# Altium project CourseWork_Boyko.PrjPcb
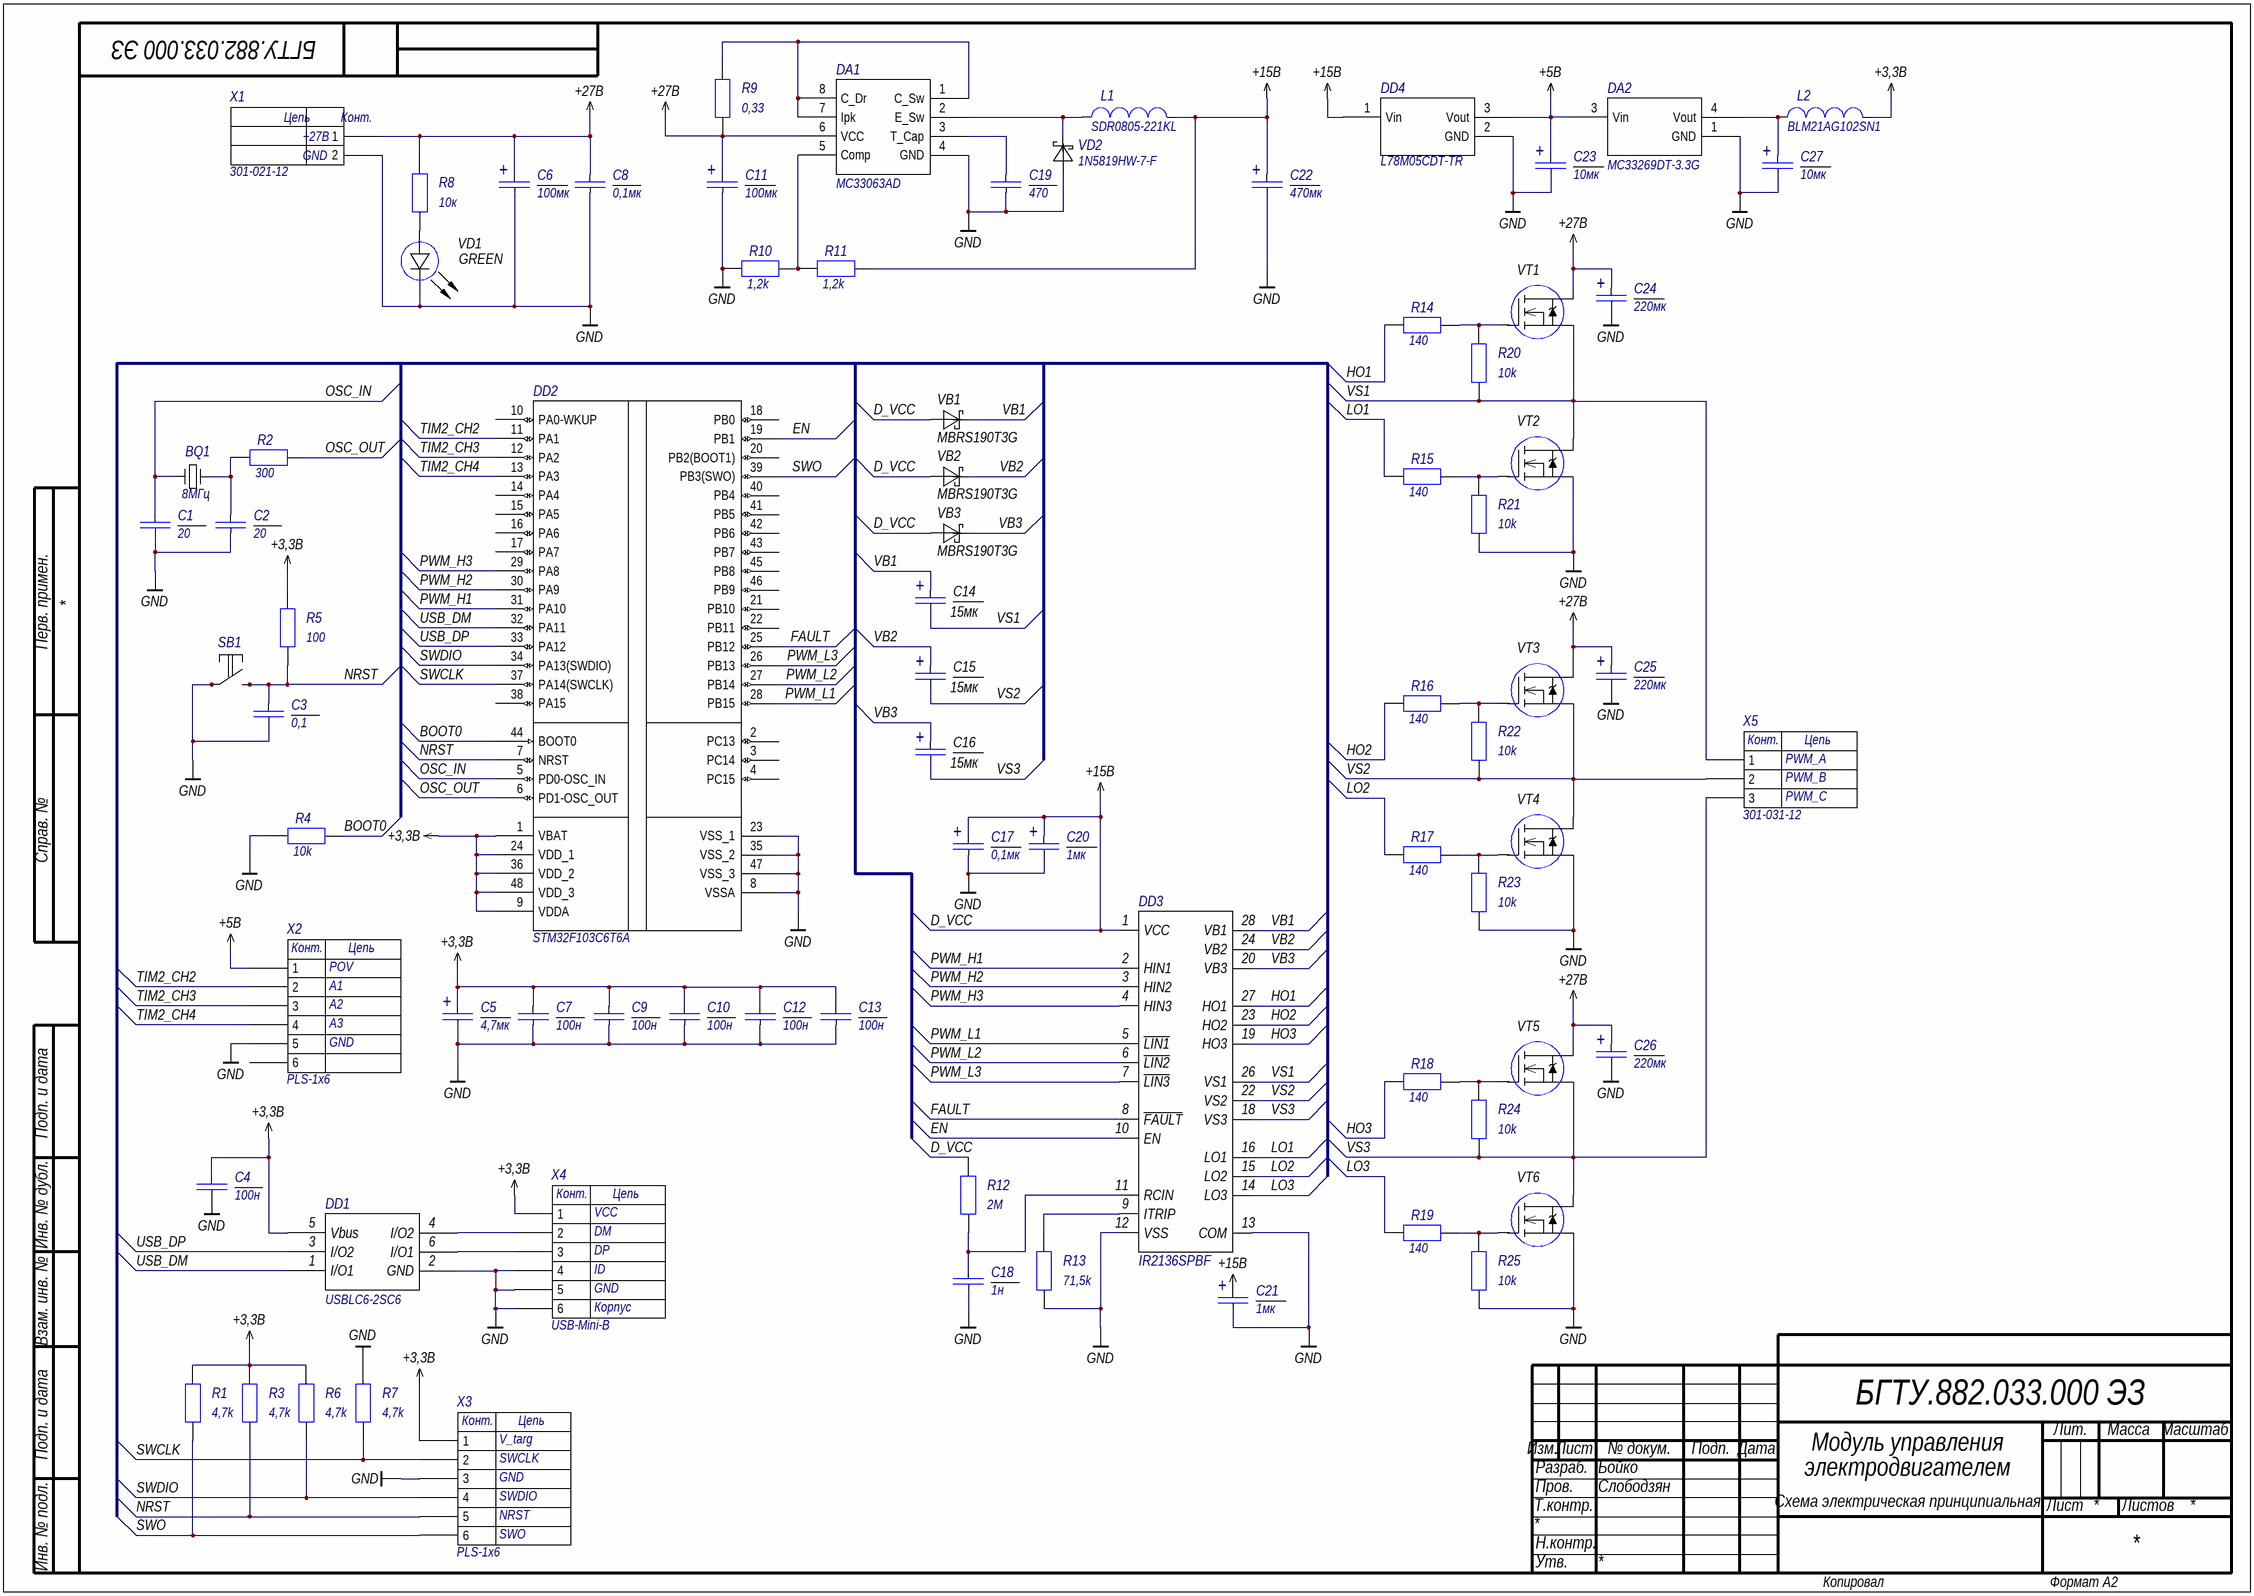
[diagram p0: EngineControlCircuitSCH_Boyko.SchDoc]
Обозначение_PCB: БГТУ.882.033.000; п_Пров_Р: Слободзян Н.С.; п_Разраб_Р: Бойко А.Ю.
1 sheet, 78 parts. Net scope: global (net labels, ports and power ports of the same name join across sheets).
Board files: EngineControl.PcbDoc, EngineControlPCBRC1.PcbDoc

## Sheet EngineControlCircuitSCH_Boyko.SchDoc
size 594 x 420 mm; CheckedBy: Слободзян; DrawnBy: Бойко; DocumentNumber: БГТУ.882.033.000 ЭЗ; Title1str: Модуль управления; Title2str: электродвигателем; DocumentType2str: Cхема электрическая принципиальная

### Parts
BQ1  8МГц  [OSC: 3225]
C1  20  [CAPC1608X90N]
C2  20  [CAPC1608X90N]
C3  0,1  [CAPC1005X55N]
C4  100н  [CAPC1005X55N]
C5  4,7мк  [CAP: TANTAL-B]
C6  100мк  [CAP: D6.3C2.5H11]
C7  100н  [CAPC1005X55N]
C8  0,1мк  [CAPC2012X135N]
C9  100н  [CAPC1005X55N]
C10  100н  [CAPC1005X55N]
C11  100мк  [CAP: SMD D6.3A6.6H7.7]
C12  100н  [CAPC1005X55N]
C13  100н  [CAPC1005X55N]
C14  15мк  [CAPMP7343X310N]
C15  15мк  [CAPMP7343X310N]
C16  15мк  [CAPMP7343X310N]
C17  0,1мк  [CAPMP3216X180N]
C18  1н  [CAPC2012X135N]
C19  470  [CAPC1005X55N]
C20  1мк  [CAPMP3216X180N]
C21  1мк  [CAP: D5C2H11]
C22  470мк  [CAP_ELEC_SIZE_G]
C23  10мк  [CAP: D5C2H11]
C24  220мк  [WCAP-ATUL 8x11.5x3.5x0.5]
C25  220мк  [WCAP-ATUL 8x11.5x3.5x0.5]
C26  220мк  [WCAP-ATUL 8x11.5x3.5x0.5]
C27  10мк  [CAP: D5C2H11]
DA1  MC33063AD  [8-SOIC-PAD]
DA2  MC33269DT-3.3G  [369A-13]
DD1  USBLC6-2SC6  [SOT23-6]
DD2  STM32F103C6T6A  [LQFP-48_N]
DD3  IR2136SPBF  [SOIC127PX1032X265-28N]
DD4  L78M05CDT-TR  [369A-13]
L1  SDR0805-221KL  [IND: SDR0805]
L2  BLM21AG102SN1  [IND: 0805]
R1  4,7k  [RES0805]
R2  300  [RES0402]
R3  4,7k  [RES0805]
R4  10k  [RES0805]
R5  100  [RES0805]
R6  4,7k  [RES0805]
R7  4,7k  [RES0805]
R8  10к  [RES0805]
R9  0,33  [RES1206]
R10  1,2k  [RES0805]
R11  1,2k  [RES0805]
R12  2M  [RES0402]
R13  71,5k  [RES0805]
R14  140  [RES0805]
R15  140  [RES0805]
R16  140  [RES0805]
R17  140  [RES0805]
R18  140  [RES0805]
R19  140  [RES0805]
R20  10k  [RES0805]
R21  10k  [RES0805]
R22  10k  [RES0805]
R23  10k  [RES0805]
R24  10k  [RES0805]
R25  10k  [RES0805]
SB1  SWT-34  [SWT-34]  (value not drawn)
VB1  MBRS190T3G  [DIODE: SMB]
VB2  MBRS190T3G  [DIODE: SMB]
VB3  MBRS190T3G  [DIODE: SMB]
VD1  Color: GREEN  [LED: 0805G]
VD2  1N5819HW-7-F  [DO-214AA]
VT1  IRFZ14PBF  [TO220]  (value not drawn)
VT2  IRFZ14PBF  [TO220]  (value not drawn)
VT3  IRFZ14PBF  [TO220]  (value not drawn)
VT4  IRFZ14PBF  [TO220]  (value not drawn)
VT5  IRFZ14PBF  [TO220]  (value not drawn)
VT6  IRFZ14PBF  [TO220]  (value not drawn)
X1  301-021-12  [301-021-12_3D]
X2  PLS-1x6  [CON: PLS-6]
X3  PLS-1x6  [CON: PLS-6]
X4  USB-Mini-B  [USB-MINI]
X5  301-031-12  [301-031-12_3D]

### Nets
+3,3B: C4.1 C5.1 C7.1 C9.1 C10.1 C12.1 C13.1 DD1.5(Vbus) DD2.1(VBAT) DD2.9(VDDA) DD2.24(VDD_1) DD2.36(VDD_2) DD2.48(VDD_3) L2.2 R1.1 R3.1 R5.1 R6.1 X3.1 X4.1
+5B: C23.1 DA2.3(Vin) DD4.3(Vout) X2.1
+27B: C6.1 C8.1 C11.1 C24.1 C25.1 C26.1 DA1.6(VCC) R8.1 R9.2 VT1.3 VT3.3 VT5.3 X1.1
D_VCC: C17.1 C20.1 C21.1 C22.1 DD3.1(VCC) DD4.1(Vin) L1.2 R11.2 R12.1 VB1.1 VB2.1 VB3.1  [also labelled +15B]
GND: C1.2 C2.2 C3.2 C4.2 C5.2 C6.2 C7.2 C8.2 C9.2 C10.2 C11.2 C12.2 C13.2 C17.2 C18.2 C19.2 C20.2 C21.2 C22.2 C23.2 C24.2 C25.2 C26.2 C27.2 DA1.4(GND) DA2.1(GND) DD1.2(GND) DD2.8(VSSA) DD2.23(VSS_1) DD2.35(VSS_2) DD2.47(VSS_3) DD3.12(VSS) DD3.13(COM) DD4.2(GND) R4.1 R7.1 R10.1 R13.2 R21.2 R23.2 R25.2 SB1.1 SB1.2 VD1.2(C) VD2.1 VT2.2 VT4.2 VT6.2 X1.2 X2.5 X3.3 X4.4 X4.5 X4.6
BOOT0: DD2.44(BOOT0) R4.2
EN: DD2.19(PB1) DD3.10(EN)
FAULT: DD2.25(PB12) DD3.8(~{FAULT})
HO1: DD3.27(HO1) R14.1
HO2: DD3.23(HO2) R16.1
HO3: DD3.19(HO3) R18.1
LO1: DD3.16(LO1) R15.1
LO2: DD3.15(LO2) R17.1
LO3: DD3.14(LO3) R19.1
NRST: C3.1 DD2.7(NRST) R3.2 R5.2 SB1.3 SB1.4 X3.5
OSC_IN: BQ1.1(OSC1) C1.1 DD2.5(PD0-OSC_IN)
OSC_OUT: DD2.6(PD1-OSC_OUT) R2.2
PWM_H1: DD2.31(PA10) DD3.2(HIN1)
PWM_H2: DD2.30(PA9) DD3.3(HIN2)
PWM_H3: DD2.29(PA8) DD3.4(HIN3)
PWM_L1: DD2.28(PB15) DD3.5(~{LIN1})
PWM_L2: DD2.27(PB14) DD3.6(~{LIN2})
PWM_L3: DD2.26(PB13) DD3.7(~{LIN3})
SWCLK: DD2.37(PA14(SWCLK)) R7.2 X3.2
SWDIO: DD2.34(PA13(SWDIO)) R6.2 X3.4
SWO: DD2.39(PB3(SWO)) R1.2 X3.6
TIM2_CH2: DD2.11(PA1) X2.2
TIM2_CH3: DD2.12(PA2) X2.3
TIM2_CH4: DD2.13(PA3) X2.4
USB_DM: DD1.1(I/O1) DD2.32(PA11)
USB_DP: DD1.3(I/O2) DD2.33(PA12)
VB1: C14.1 DD3.28(VB1) VB1.2
VB2: C15.1 DD3.24(VB2) VB2.2
VB3: C16.1 DD3.20(VB3) VB3.2
VS1: C14.2 DD3.26(VS1) R20.2 VT1.2 VT2.3 X5.1
VS2: C15.2 DD3.22(VS2) R22.2 VT3.2 VT4.3 X5.2
VS3: C16.2 DD3.18(VS3) R24.2 VT5.2 VT6.3 X5.3
NetBQ1_3: BQ1.3(OSC2) C2.1 R2.1
NetC18_1: C18.1 DD3.11(RCIN) R12.2
NetC19_1: C19.1 DA1.3(T_Cap)
NetC27_1: C27.1 DA2.4(Vout) L2.1
NetDA1_1: DA1.1(C_Sw) DA1.7(Ipk) DA1.8(C_Dr) R9.1
NetDA1_2: DA1.2(E_Sw) L1.1 VD2.2
NetDA1_5: DA1.5(Comp) R10.2 R11.1
NetDD1_4: DD1.4(I/O2) X4.2
NetDD1_6: DD1.6(I/O1) X4.3
NetDD3_9: DD3.9(ITRIP) R13.1
NetR8_2: R8.2 VD1.1(A)
NetR14_2: R14.2 R20.1 VT1.1
NetR15_2: R15.2 R21.1 VT2.1
NetR16_2: R16.2 R22.1 VT3.1
NetR17_2: R17.2 R23.1 VT4.1
NetR18_2: R18.2 R24.1 VT5.1
NetR19_2: R19.2 R25.1 VT6.1

Not connected (* = marked no-connect by the designer): DD2 2(PC13) 3(PC14) 4(PC15) 10(PA0-WKUP) 14(PA4) 15(PA5) 16(PA6) 17(PA7) 18(PB0) 20(PB2(BOOT1)) 21(PB10) 22(PB11) 38(PA15) 40(PB4) 41(PB5) 42(PB6) 43(PB7) 45(PB8) 46(PB9); X2 6

### Notes on the sheet
- Перв. примен.
- Справ. №
- Подп. и дата
- Инв. № дубл.
- Взам. инв. №
- Изм.
- Лист
- № докум.
- Подп.
- Дата
- Лит.
- Масса
- Масштаб
- Т.контр.
- Пров.
- Разраб.
- Листов
- Инв. № подл.
- Н.контр.
- Утв.
- Копировал
- Формат А2
- (in symbol 301-021-12) Цепь; Конт.
- (in symbol 301-031-12) Конт.; Цепь
- (in symbol PLS-1x6) Конт.; Цепь
- (in symbol TAJC156K016RNJ) +
- (in symbol USB-Mini-A) Конт.; Цепь; Корпус
- (in symbol Сapacitor_Pol) +
- (in symbol Сapacitor_Pol_1) +

### Library data of the parts
BQ1 = SMD0503: Кварцевый резонатор Кварцевые резонаторы 8МГц в SMD корпусах 3.2x2.5мм на расширенный интервал температур 8000 \SMD03225C4\12\ 30\ 50/-40~115C\DSX321G\1Г; ValueManufacturer: Китай; ValueDescription: Кварцевый резонатор; ValueManufacturerPartNumber: SMD0503; ValueType: SMD0503; ValueValue: 8МГц; HelpURL: https://www.chipdip.ru/product0/8004084827
C1 C2 = Сapacitor: Кер.ЧИП конд. 20пФ NPO 50В 5% 0603, GRM1885C1H200J; ValueManufacturerPartNumber: "" -; ValueType_TU: Конденсаторы; ValueDescription: Конденсатор; HelpURL: https://www.chipdip.ru/product/grm1885c1h200j
C3 = Сapacitor: 04025A1R0BAT2A, Cap Ceramic 1pF 50V C0G 0.1pF Pad SMD 0402 125C T/R; ValueManufacturerPartNumber: "" -; ValueType_TU: Конденсаторы; ValueDescription: Конденсатор; HelpURL: https://www.chipdip.ru/product0/8003206973
C4 C7 C9 C10 C12 C13 = Сapacitor: Кер.чип.конд. 0402 X5R 100нФ 16В 10%, GRM155R61C104KA88D; ValueManufacturerPartNumber: "" -; ValueType_TU: Конденсаторы; ValueDescription: Конденсатор; HelpURL: https://www.chipdip.ru/product/grm155r61c104ka88d
C5 = Сapacitor_Pol: Конденсатор танталовый SMD 4,7uF 16V 20% case B; ValueManufacturerPartNumber: "" -; ValueDescription: Конденсатор полярный; ValueType_TU: Конденсаторы; HelpURL: https://www.chipdip.ru/product0/8003918018
C6 = Сapacitor_Pol_1: 100мкф 35в 105° RD (6.3X11) конденсатор SAMWHA RD1V107M6L011BB; ValueManufacturer: TECAP; ValueManufacturerPartNumber: D "D" 27В-100мк 20%; ValueDescription: Конденсатор танталовый SMD; ValuePackage: D; ValueTolerance: 20%; ValueType_TU: Конденсаторы D; ValueVoltage: 27В; ValueType: D; ValueValue: 100мк; ComponentLink1Description: New link; ComponentLink1URL: *; HelpURL: https://www.chipdip.ru/product0/9000617586
C8 = Сapacitor: Кер.ЧИП конд. 0.1 мкФ Y5V 50В+80-20% 0805, GRM219F51H104Z; ValueManufacturerPartNumber: "" -; ValueType_TU: Конденсаторы; ValueDescription: Конденсатор; HelpURL: https://www.chipdip.ru/product/grm219f51h104z
C11 = Сapacitor_Pol: 107SML035M, CAP, 100UF, 35V, ALU ELEC, SMD; ValueManufacturerPartNumber: "" -; ValueType_TU: Конденсаторы; ValueDescription: Конденсатор полярный; HelpURL: https://www.chipdip.ru/product/107sml035m
C14-C16 = TAJC156K016RNJ: 15мкф 16в SMD разм.C 10% тантал. конденсатор TAJC156K016RNJ; HelpURL: https://www.chipdip.ru/product0/8001593097
C17 = Сapacitor_Pol_1: TECAP, 0.1 мкФ, 35 В, тип A, 10%, Конденсатор танталовый SMD; ValueManufacturerPartNumber: D "D" 27В-0,1мк 20%; ValuePackage: D; ValueTolerance: 20%; ValueType_TU: Конденсаторы D; ValueVoltage: 27В; ValueDescription: Конденсатор танталовый SMD; ValueManufacturer: TECAP; ValueType: D; ValueValue: 0,1мк; HelpURL: https://www.chipdip.ru/product0/1654
C18 = Сapacitor: Кер.ЧИП конд. 1000пФ X7R 50В,10%, 0805; ValueManufacturerPartNumber: "" -; ValueDescription: Конденсатор; ValueType_TU: Конденсаторы; HelpURL: https://www.chipdip.ru/product0/40582
C19 = Сapacitor: 470пф X7R 50в 10% (0402) Чип керам,конденсатор MA0402XR471K500PRG; ValueManufacturerPartNumber: "" -; ValueType_TU: Конденсаторы; ValueDescription: Конденсатор; HelpURL: https://www.chipdip.ru/product0/8001662121
C20 = Сapacitor_Pol_1: Сapacitor_Pol; ValueManufacturer: TECAP; ValueManufacturerPartNumber: D "D" 27В-1мк 20%; ValueDescription: Конденсатор танталовый SMD; ValuePackage: D; ValueTolerance: 20%; ValueType_TU: Конденсаторы D; ValueVoltage: 27В; ValueType: D; ValueValue: 1мк; HelpURL: https://www.chipdip.ru/product0/19661
C21 = Сapacitor_Pol: ECAP (К50-35), 1мкФ, 50В, 105°C, 20%, 5x11мм P:2мм, Конденсатор электролитический алюминиевый JRB1H010M02000500110000B; ValueManufacturerPartNumber: "" -; ValueDescription: Конденсатор полярный; ValueType_TU: Конденсаторы; HelpURL: https://www.chipdip.ru/product0/9000565817
C22 = Сapacitor_Pol: EEEFC1E471P, SMD эл-лит 25V 470uF /10*10.2/105°C; ValueManufacturerPartNumber: "" -; ValueType_TU: Конденсаторы; ValueDescription: Конденсатор полярный; HelpURL: https://www.chipdip.ru/product0/8002405648
C23 C27 = Сapacitor_Pol: ECAP (К50-35), 10 мкФ, 16 В, 105°C, TK 5X11, TKR100M1CD11, Конденсатор электролитический алюминиевый; ValueManufacturerPartNumber: "" -; ValueDescription: Конденсатор полярный; ValueType_TU: Конденсаторы; HelpURL: https://www.chipdip.ru/product0/9000247150
C24-C26 = Сapacitor_Pol_1: 860010574011, Электролитический конденсатор, 220 мкФ, 35 В, Серия WCAP-ATG8, ± 20%, Радиальные Выводы, 8 мм; ValueManufacturer: TECAP; ValueManufacturerPartNumber: D "D" 27В-220мк 20%; ValueDescription: Конденсатор танталовый SMD; ValuePackage: D; ValueType_TU: Конденсаторы D; ValueVoltage: 27В; ValueTolerance: 20%; ValueType: D; ValueValue: 220мк; HelpURL: https://www.chipdip.ru/product/860010574011
DA1 = MC33063AD: Повышающий/ понижающий преобразователь напряжения [SO8] 1,5А; ValueManufacturer: ON Semiconductor; ValuePackage: SO-8; ValueAnalog1: 1356ЕФ1У; ValueAnalog2: MC34063ADG; ValueDescription: Повышающий/ понижающий преобразователь напряжения [SO8] 1,5А; ValueManufacturerPartNumber: MC33063AD; ValueType: MC33063AD
DA2 = MC33269DT-3.3G: Регулятор с малым падением напряжения, 800мА, 3.3В MC33269DT-3.3G, LDO линейный регулятор напряжения, +3.3В, 800мА, [D-PAK]; ValueManufacturer: ON Semiconductor; ValueDescription: DC-DC регулятор; ValueManufacturerPartNumber: MC33269DT-3.3G; ValuePackage: 369A-13; ValueType: MC33269DT-3.3G; HelpURL: https://www.chipdip.ru/product/mc33269dt-3.3g
DD1 = USBLC6-2SC6: Защита интерфейса USB от электростатических разрядов USBLC6-2SC6, Защита интерфейса USB от электростатических разрядов [SOT-23-6]; HelpURL: https://www.chipdip.ru/product/usblc6-2sc6
DD2 = STM32F103CBT6: ARM Cortex-M3 32-bit MCU, 128 KB Flash, 20 KB Internal RAM, 37 I/Os, 48-pin LQFP, -40 to 85 degC, Tray; A/D Converter: 2x12-bit (10 Channel); FLASH Size (Prog) (kB): 128; I/Os (High Current): 37; Internal RAM Size (kB): 20; Operating Frequency(F) (Processor speed) (MHz): 72; Supply Voltage(Vcc) min (V): 2; DatasheetVersion: Rev. 16; PackageVersion: Rev. 6, 06/2013; PackageReference: LQFP48; PackageDescription: 48-Pin Low Profile Quad Flat Package, 7 x 7 mm Body, 0.5 mm Pitch; Supplier 1: Farnell; Supplier Part Number 1: 1606327; Supplier 2: Newark; Supplier Part Number 2: 11N8296; Supplier 3: Newark; Supplier Part Number 3: 57P1214; Core: ARM Cortex-M3; Packing: Tray; Mounting Technology: Surface Mount; PartNumber: STM32F103CBT6; ComponentLink1Description: Manufacturer URL; ComponentLink1URL: http://www.st.com/web/en/home.html; ComponentLink2Description: Datasheet; ComponentLink2URL: http://www.st.com/st-web-ui/static/active/en/resource/technical/document/datasheet/CD00161566.pdf; ComponentLink3Description: Package Specification; ComponentLink3URL: http://www.st.com/st-web-ui/static/active/en/resource/technical/document/datasheet/DM00058181.pdf; HelpURL: https://www.chipdip.ru/product/stm32f103c6t6a
DD3 = IR2136SPBF: Floating channel designed for bootstrap operation | Fully operational to +600 V | Tolerant to negative transient voltage, dV/dt immune | Gate drive supply range from 10 V to 20 V | Undervoltage lockout for all channels | Over-current shutdown turns off all six drivers | Independent 3 half-bridge drivers | Matched propagation delay for all channels | Cross-conduction prevention logic | Low side output out of phase with inputs. High side outputs out of phase | 3.3 V logic compatible | Lower di/dt gate drive for better noise immunity | Externally programmable delay for automatic fault clear | Variations include IR21363S; MF: Infineon; Package: SOIC-28 Infineon; Digi-Key_Purchase_URL: https://www.digikey.com/product-detail/en/infineon-technologies/IR2136SPBF/IR2136SPBF-ND/856515?utm_source=snapeda&utm_medium=aggregator&utm_campaign=symbol; Value: *; MP: IR2136SPBF; SnapEDA_Link: https://www.snapeda.com/parts/IR2136SPBF/Infineon%20Technologies/view-part/559407/?ref=snap; Digi-Key_Part_Number: IR2136SPBF-ND; HelpURL: https://www.chipdip.ru/product/ir2136spbf
DD4 = L78M05CDT-TR: L78M05CDT-TR, Прецизионный регулятор напряжения, 500мА, 5В, [TO-252]; HelpURL: https://www.chipdip.ru/product/l78m05cdt
L1 = B82477G4154M: SDR0805-221KL, 220 мкГн, Индуктивность SMD; ValueManufacturer: Epcos; ValueDescription: Катушка индуктивности SMD; ValuePackage: 12.8х12.8; ValueCurrent: 1,42 А; ValueValue: 150мкГн; ValueManufacturerPartNumber: B82477G4154M; ValueType: B82477G4154M; HelpURL: https://www.chipdip.ru/product/sdr0805-221kl
L2 = BLM21AG102SN1: Дроссель подавления ЭМП BLM21AG102SN1, 0805, Дроссель подавления ЭМП; ValueManufacturer: Murata Manufacturing; ValuePackage: 0805; ValueCurrent: 0,2 А; ValueValue: 20мГн; ValueDescription: Дроссель подавления ЭМП; ValueManufacturerPartNumber: BLM21AG102SN1; ValueType: BLM21AG102SN1; HelpURL: https://www.chipdip.ru/product/blm21ag102sn1
R1 R3 R6 R7 = Resistor: 0.125Вт 0805 4.7 кОм, 1%, Чип резистор (SMD) RC0805FR-074K7L; ValueManufacturerPartNumber: "" -; ValueType_TU: Резисторы; ValueDescription: Резистор; HelpURL: https://www.chipdip.ru/product0/9000079502
R2 = Resistor: 0.062Вт 0402 300 Ом, 1%, Чип резистор (SMD) RC0402FR-07300RL; ValueManufacturerPartNumber: "" -300; ValueType_TU: Резисторы; ValueDescription: Резистор; ValueValue: 300; HelpURL: https://www.chipdip.ru/product0/9000189775
R4 = Resistor: 0.125Вт 0805 10 кОм, 5%, Чип резистор (SMD); ValueManufacturerPartNumber: "" -10k; ValueType_TU: Резисторы; ValueDescription: Резистор; ValueValue: 10k; HelpURL: https://www.chipdip.ru/product0/528580584
R5 = Resistor: RC0402JR-07100RL; ValueManufacturerPartNumber: "" -; ValueDescription: Резистор; ValueType_TU: Резисторы; HelpURL: https://www.chipdip.ru/product0/9000189639
R8 = Resistor: Резистор RC0805JR-0710KL 0.125Вт 0805 10 кОм, 5%, Чип резистор (SMD) /; ValueManufacturerPartNumber: "" -; ValueType_TU: Резисторы; ValueDescription: Резистор; HelpURL: https://www.chipdip.ru/product0/528580584
R9 = Resistor: 0,33ом 5% RS-06 1/4W (1206) Чип резистор RS-06KR33JT; ValueManufacturerPartNumber: "" -; ValueType_TU: Резисторы; ValueDescription: Резистор; HelpURL: https://www.chipdip.ru/product0/8001592128
R10 R11 = Resistor: Резистор постоянный SMD 0805 1,2K 5% / 0805S8J0122T5E; ValueManufacturerPartNumber: "" -300; ValueType_TU: Резисторы; ValueValue: 300; ValueDescription: Резистор; HelpURL: https://www.chipdip.ru/product0/8004210618
  R11: ComponentLink1Description: New link
R12 = Resistor: 0.062Вт 0402 2 МОм, 1%, Чип резистор (SMD); ValueManufacturerPartNumber: "" -; ValueType_TU: Резисторы; ValueDescription: Резистор; HelpURL: https://www.chipdip.ru/product0/9000189945
R13 = Resistor: 71,5 кОм 0805 1% CR05FL7-71K5 чип-резистор Viking tech; ValueManufacturerPartNumber: "" -; ValueType_TU: Резисторы; ValueDescription: Резистор; HelpURL: https://www.chipdip.ru/product0/8002867086
R14-R19 = Resistor: RC0805FR-07140RL, чип 0805 140 1%; ValueManufacturerPartNumber: "" -140; ValueDescription: Резистор; ValueType_TU: Резисторы; ValueValue: 140; HelpURL: https://www.chipdip.ru/product0/8406612868
R20-R25 = Resistor: RC0805FR-0710KL; ValueManufacturerPartNumber: "" -; ValueDescription: Резистор; ValueType_TU: Резисторы; HelpURL: https://www.chipdip.ru/product0/9000079514
SB1 = SWT-34: Тактовый переключатель SMD h=7мм (SDTM-630-N) (TS-06M-CSM); ValueManufacturer: Тайвань; ValueDescription: Кнопка тактовая; ValueType: SWT-34; ValueManufacturerPartNumber: SWT-34; ValuePackage: SWT-34; HelpURL: https://www.chipdip.ru/product/swt-34
VB1-VB3 = MBRS190T3G: Диод Шоттки 90В 1А MBRS190T3G, Диод Шоттки 90В 1А [SMB / DO-214AA]; ValueType: *; HelpURL: https://www.chipdip.ru/product/mbrs190t3g-ons
VD1 = LED_single: SML-LXT0805GW-TR, Светодиод, QuasarBrite, Зеленый, SMD (Поверхностный Монтаж), 0805, 20 мА, 2.2 В, 565 нм; ValueManufacturerPartNumber: LED, Green, *, *, *, -55...+150°C; TypeDiode: LED; Manufacturer: *; Package: *; HelpURL: https://www.chipdip.ru/product/sml-lxt0805gw-tr-led-green-11mcd-565nm; Temperature: -55...+150°C; Current: *; VoltageDrop: *; PartNumber: *; ColorParameter: Green
VD2 = SS24: Диод Шоттки 1N5819HW-7-F; ValueManufacturer: Fairchild Semiconductor; ValueCurrent: 2А; ValueMaxReverseVoltage: 40В; ValueDescription: Диод Шоттки 2А 40В; ValueManufacturerPartNumber: SS24; ValuePackage: DO-214AA; ValueType: SS24; HelpURL: https://www.chipdip.ru/product0/8004285286
VT1-VT6 = IRFZ14PBF: IRFZ14PBF, Транзистор, N-канал 60В 10А [TO-220AB]; HelpURL: https://www.chipdip.ru/product/irfz14
X1 = 301-021-12: Клеммник винтовой, 2-контактный, 5мм, прямой KLS2-305V-5.00-02P-2S (DG305-5.0-02P-12), Клеммник винтовой, 2-контактный, 5мм, прямой; ValueManufacturer: Ningbo Xinya M&E; A1TXT: +27В; A2TXT: GND; ValueDescription: Клеммник винтовой, 2-контактный, 5мм, прямой; ValueManufacturerPartNumber: 301-021-12; ValueType: 301-021-12; HelpURL: https://www.chipdip.ru/product/kls2-305v-5.00-02p-2s-dg305-5.0-02p-12
X2 = PLS-1x6: PLS-6 (DS1021-1x6), Вилка штыревая 2.54мм 1x6 прямая тип1; ValueManufacturer: Ningbo Zhenqin Electronic (Connfly Electronic); A1TXT: POV; A2TXT: A1; A3TXT: A2; A4TXT: A3; A5TXT: GND; ValueDescription: Вилка штыревая 2.54мм 1x6; ValueManufacturerPartNumber: PLS-1x6; ValueType: PLS-1x6; HelpURL: https://www.chipdip.ru/product/pls-6
X3 = PLS-1x6: PLS-6 (DS1021-1x6), Вилка штыревая 2.54мм 1x6 прямая тип1; ValueManufacturer: Ningbo Zhenqin Electronic (Connfly Electronic); A1TXT: V_targ; A2TXT: SWCLK; A3TXT: GND; A6TXT: SWO; A4TXT: SWDIO; A5TXT: NRST; ValueDescription: Вилка штыревая 2.54мм 1x6; ValueManufacturerPartNumber: PLS-1x6; ValueType: PLS-1x6; HelpURL: https://www.chipdip.ru/product/pls-6
X4 = USB-Mini-A: Розетка 5-контактная SMD на плату 1734035-2, Разъем USB, Mini USB Типа B, USB 2.0, Гнездо, 5 вывод(-ов), Поверхностный Монтаж, Прямой Угол; ValueManufacturer: Ningbo Xinya M&E; A1TXT: VCC; A2TXT: DM; A3TXT: DP; A4TXT: ID; A5TXT: GND; ValueType: USB-Mini-B; ValueManufacturerPartNumber: USB-Mini-B; ValueDescription: Розетка 5-контактная SMD на плату; HelpURL: https://www.chipdip.ru/product0/9000362778
X5 = 301-031-12: Клеммник винтовой, 3-контактный, 5мм, прямой; ValueManufacturer: Ningbo Xinya M&E; A1TXT: PWM_A; A2TXT: PWM_B; A3TXT: PWM_C; ValueDescription: Клеммник винтовой, 3-контактный, 5мм, прямой; ValueManufacturerPartNumber: 301-031-12; ValueType: 301-031-12; HelpURL: https://www.chipdip.ru/product/301-031-12